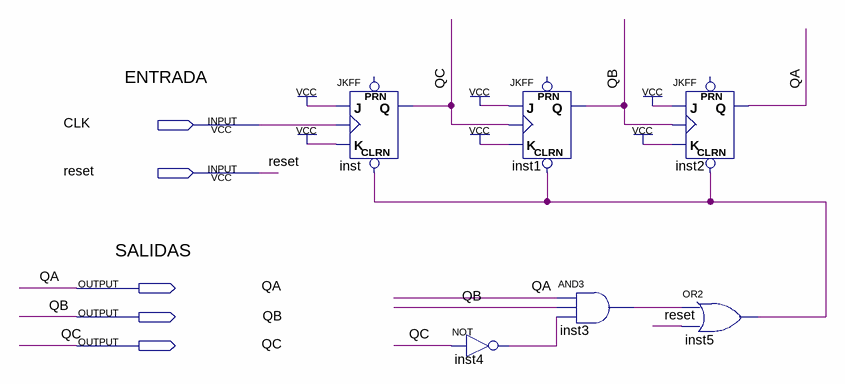
[diagram p0: schematic sheet]
// Quartus schematic contador.bdf as structural Verilog: 6 symbols, 5 pins
module contador (
  input  CLK,
  input  reset,
  output QA,
  output QB,
  output QC
);

  wire inst3_out, inst4_out, inst5_out;

  JKFF inst (.CLRN(inst5_out), .K(1'b1), .J(1'b1), .CLK(CLK), .Q(QC));  // open: PRN
  not inst4 (inst4_out, QC);
  JKFF inst1 (.CLRN(inst5_out), .K(1'b1), .J(1'b1), .CLK(QC), .Q(QB));  // open: PRN
  and inst3 (inst3_out, QA, QB, inst4_out);
  JKFF inst2 (.CLRN(inst5_out), .K(1'b1), .J(1'b1), .CLK(QB), .Q(QA));  // open: PRN
  or inst5 (inst5_out, inst3_out, reset);

  // Notes on the sheet:
  //   ENTRADA
  //   SALIDAS
endmodule
